# EAGLE board OSSIOBC (EAGLE 6.1)
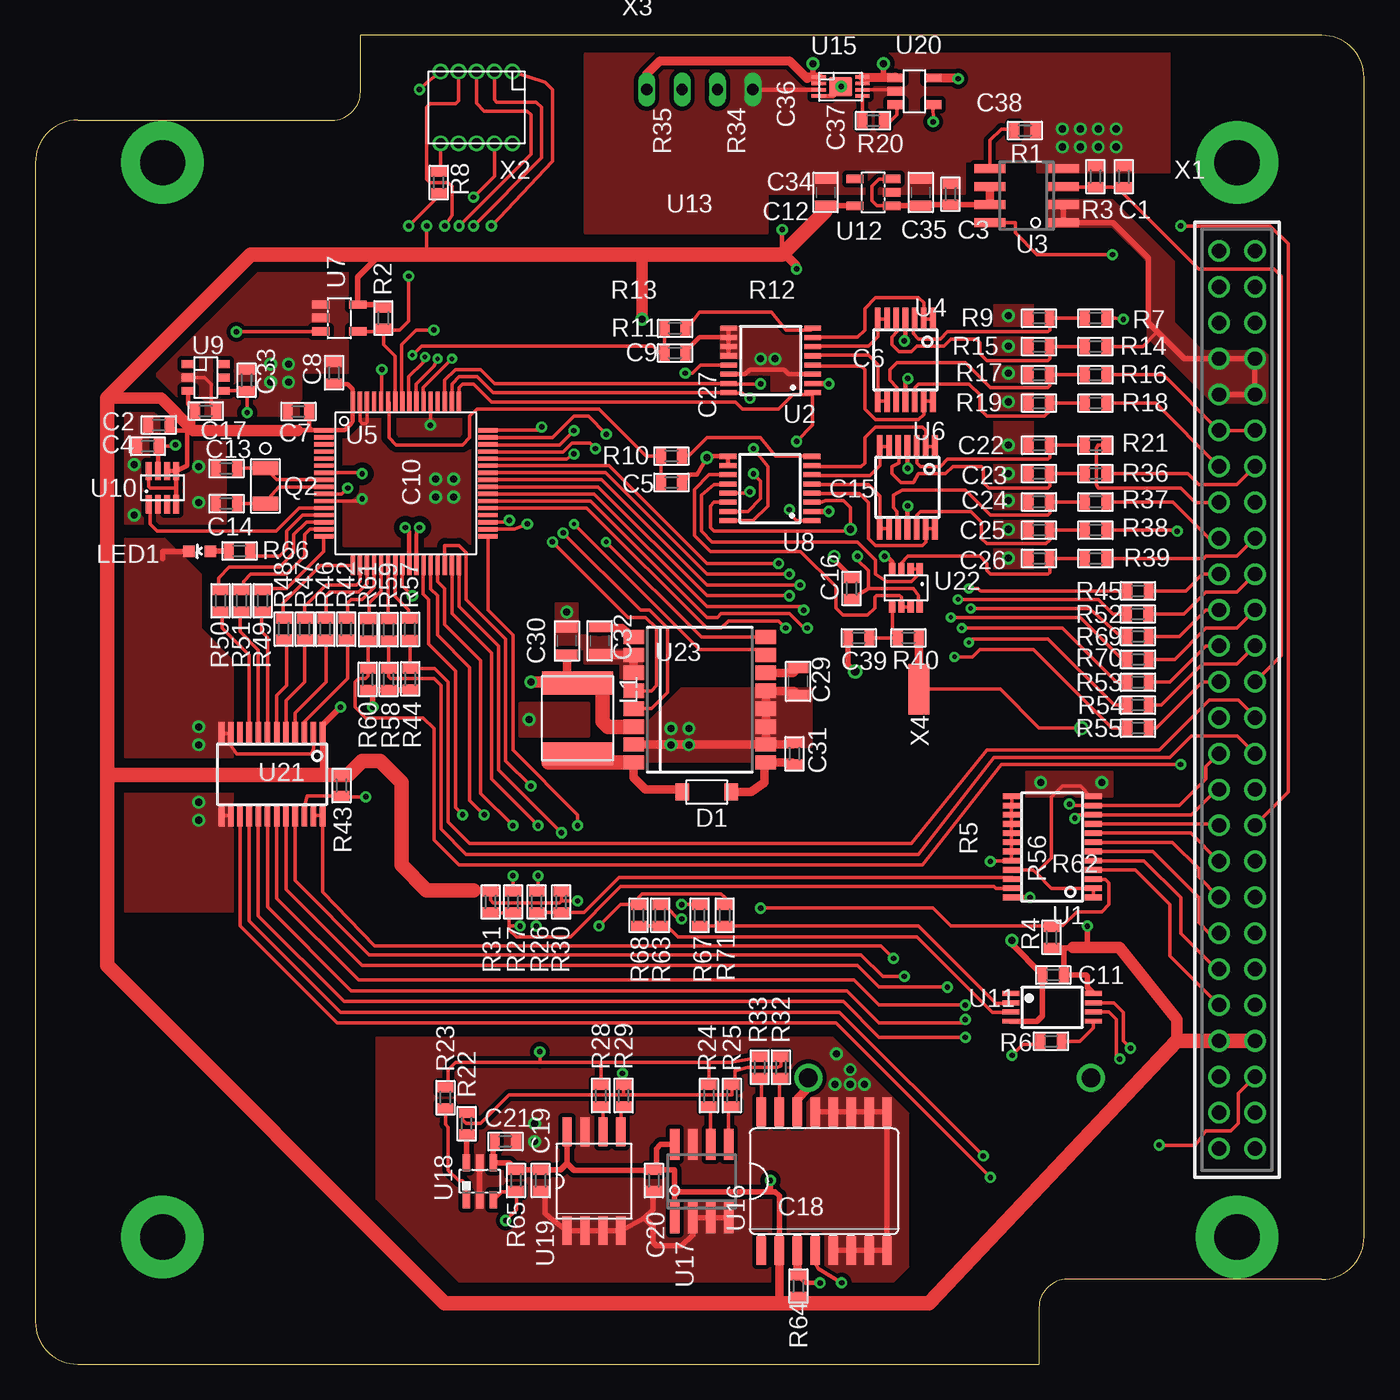
[diagram p4: board, top side]
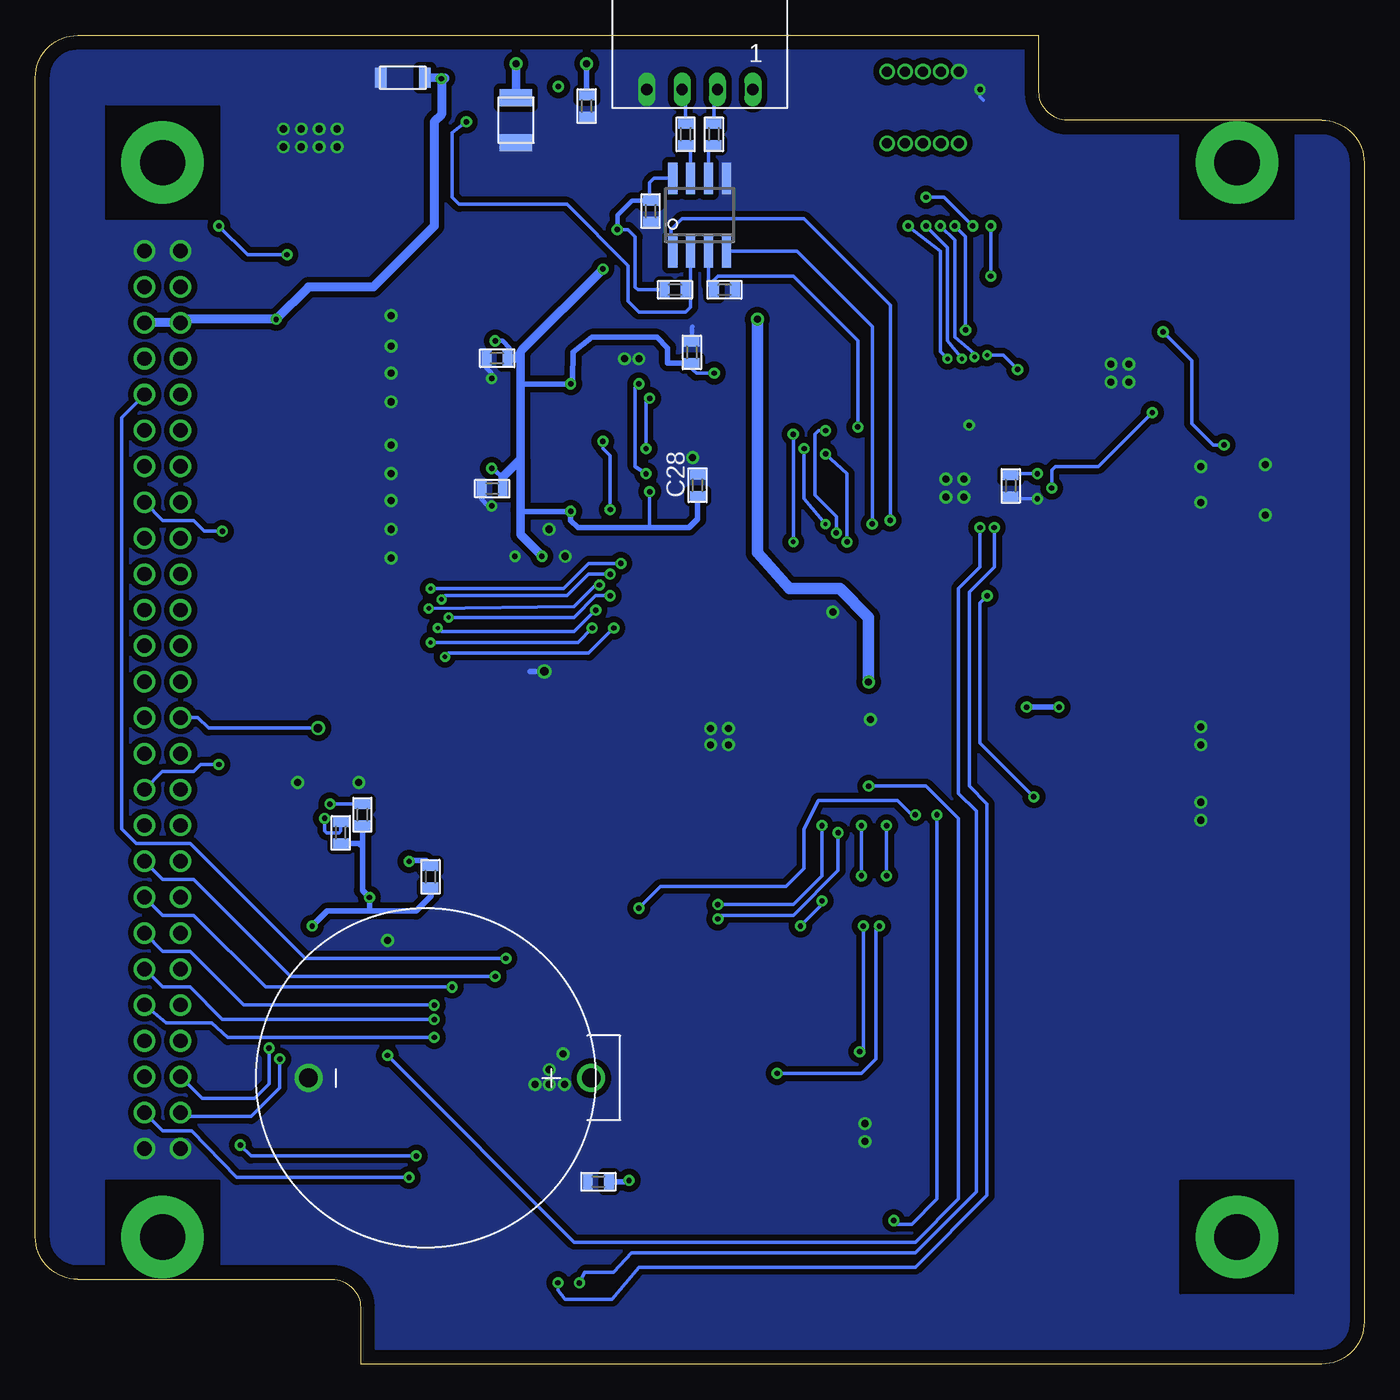
[diagram p5: board, bottom side, seen from below]

Size 94 x 94 mm. Coordinates in mm from the lower left corner, seen from the top.
Outline: 3,88 21,88 arc90 23,90 23,94 91,94 arc-90 94,91 94,9 arc-90 91,6 73,6 arc90 71,4 71,0 3,0 arc-90 0,3 0,85 arc-90 3,88
Copper layers (1*16): Top 0.035mm / dielectric 1.5mm / Bottom 0.035mm
Design rules: minimum track width 8mil, minimum drill 10mil, track to track 8mil, track to pad 8mil, pad to pad 4mil, via to via 8mil, smd to smd 2mil, copper to edge 40mil, drill to drill 8mil, minimum pad ring 8mil, minimum via ring 8mil, stop-mask expansion 4mil, vias tented up to drill 0mil, thermal gap 10mil

## Footprints (pad centres in the part's own frame; a part is rotated, then mirrored left to right if it is on the bottom)
BH32T-C-G = drill 1.32: N 0,8.3; P 0,-11.7
C0603(1608) = smd 0.7 x 1.1: 1 -0.75,0; 2 0.75,0
C0805(2012) = smd 0.7 x 1.5: 1 -0.95,0; 2 0.95,0
C1210-GCM32 = smd 1.2 x 2.3: P$1 -1.6,0; P$2 1.6,0
C1206-GCM31 = smd 0.8 x 1.4: P$1 -1.55,0; P$2 1.55,0
SOD-123 = smd 0.97 x 1.2: A -1.735,0; C 1.735,0
3.2-PAD-ROUND = drill 3.2 pad 5.842: B3,2 0,0
L(2220) = smd 1.6 x 5: P$1 -2.5,0; P$2 2.5,0
LED-0603 = smd 0.8 x 0.8: A 0,-0.75; C 0,0.75
NX-3215 = smd 1 x 1.8: 1 -1.25,0; 2 1.25,0
R0603(1608) = smd 0.7 x 1.1: 1 -0.75,0; 2 0.75,0
TSSOP-24-PW = smd 0.4 x 1.2: 1 -3.575,-2.9; 2 -2.925,-2.9; 3 -2.275,-2.9; 4 -1.625,-2.9; 5 -0.975,-2.9; 6 -0.325,-2.9; 7 0.325,-2.9; 8 0.975,-2.9; 9 1.625,-2.9; 10 2.275,-2.9; 11 2.925,-2.9; 12 3.575,-2.9; 13 3.575,2.9; 14 2.925,2.9; 15 2.275,2.9; 16 1.625,2.9; 17 0.975,2.9; 18 0.325,2.9; 19 -0.325,2.9; 20 -0.975,2.9; 21 -1.625,2.9; 22 -2.275,2.9; 23 -2.925,2.9; 24 -3.575,2.9
TSSOP16-RU = smd 1.19 x 0.36: 1 -2.97,2.275; 2 -2.97,1.625; 3 -2.97,0.975; 4 -2.97,0.325; 5 -2.97,-0.325; 6 -2.97,-0.975; 7 -2.97,-1.625; 8 -2.97,-2.275; 9 2.97,-2.275; 10 2.97,-1.625; 11 2.97,-0.975; 12 2.97,-0.325; 13 2.97,0.325; 14 2.97,0.975; 15 2.97,1.625; 16 2.97,2.275
SO8 = smd 0.65 x 2.2: 1 -1.905,-2.6; 2 -0.635,-2.6; 3 0.635,-2.6; 4 1.905,-2.6; 5 1.905,2.6; 6 0.635,2.6; 7 -0.635,2.6; 8 -1.905,2.6
TSSOP14-PW = smd 0.4 x 1.6: 1 -1.95,-2.9; 2 -1.3,-2.9; 3 -0.65,-2.9; 4 0,-2.9; 5 0.65,-2.9; 6 1.3,-2.9; 7 1.95,-2.9; 8 1.95,2.9; 9 1.3,2.9; 10 0.65,2.9; 11 0,2.9; 12 -0.65,2.9; 13 -1.3,2.9; 14 -1.95,2.9
PM/PAG64 = smd 1.4 x 0.3: 1 -5.8,3.75; 2 -5.8,3.25; 3 -5.8,2.75; 4 -5.8,2.25; 5 -5.8,1.75; 6 -5.8,1.25; 7 -5.8,0.75; 8 -5.8,0.25; 9 -5.8,-0.25; 10 -5.8,-0.75; 11 -5.8,-1.25; 12 -5.8,-1.75; 13 -5.8,-2.25; 14 -5.8,-2.75; 15 -5.8,-3.25; 16 -5.8,-3.75; 33 5.8,-3.75; 34 5.8,-3.25; 35 5.8,-2.75; 36 5.8,-2.25; 37 5.8,-1.75; 38 5.8,-1.25; 39 5.8,-0.75; 40 5.8,-0.25; 41 5.8,0.25; 42 5.8,0.75; 43 5.8,1.25; 44 5.8,1.75; 45 5.8,2.25; 46 5.8,2.75; 47 5.8,3.25; 48 5.8,3.75 | smd 0.3 x 1.4: 17 -3.75,-5.8; 18 -3.25,-5.8; 19 -2.75,-5.8; 20 -2.25,-5.8; 21 -1.75,-5.8; 22 -1.25,-5.8; 23 -0.75,-5.8; 24 -0.25,-5.8; 25 0.25,-5.8; 26 0.75,-5.8; 27 1.25,-5.8; 28 1.75,-5.8; 29 2.25,-5.8; 30 2.75,-5.8; 31 3.25,-5.8; 32 3.75,-5.8; 49 3.75,5.8; 50 3.25,5.8; 51 2.75,5.8; 52 2.25,5.8; 53 1.75,5.8; 54 1.25,5.8; 55 0.75,5.8; 56 0.25,5.8; 57 -0.25,5.8; 58 -0.75,5.8; 59 -1.25,5.8; 60 -1.75,5.8; 61 -2.25,5.8; 62 -2.75,5.8; 63 -3.25,5.8; 64 -3.75,5.8
SOT23-5DBV = smd 0.6 x 1.22: 1 -0.95,-1.3; 2 0,-1.3; 3 0.95,-1.3; 4 0.95,1.3; 5 -0.95,1.3
TSOT-6UJ-6 = smd 0.55 x 0.9: 1 -0.95,-1.25; 2 0,-1.25; 3 0.95,-1.25; 4 0.95,1.25; 5 0,1.25; 6 -0.95,1.25
SOT23-8 = smd 0.42 x 1.3: 1 -0.975,-1.175; 2 -0.325,-1.175; 3 0.325,-1.175; 4 0.975,-1.175; 5 0.975,1.175; 6 0.325,1.175; 7 -0.325,1.175; 8 -0.975,1.175
TSSOP-8 = smd 1.2 x 0.35: 1 -2.925,0.975; 2 -2.925,0.325; 3 -2.925,-0.325; 4 -2.925,-0.975; 5 2.925,-0.975; 6 2.925,-0.325; 7 2.925,0.325; 8 2.925,0.975
DFN8-2X3 = smd 0.25 x 1: 1 -0.675,-1.55; 2 -0.225,-1.55; 3 0.225,-1.55; 4 0.675,-1.55; 5 0.675,1.55; 6 0.225,1.55; 7 -0.225,1.55; 8 -0.675,1.55 | smd 1.35 x 1.65: 9 0,0
SO16L = smd 0.66 x 2.032: 1 -4.445,-4.902; 2 -3.175,-4.902; 3 -1.905,-4.902; 4 -0.635,-4.902; 5 0.635,-4.902; 6 1.905,-4.902; 7 3.175,-4.902; 8 4.445,-4.902; 9 4.445,4.902; 10 3.175,4.902; 11 1.905,4.902; 12 0.635,4.902; 13 -0.635,4.902; 14 -1.905,4.902; 15 -3.175,4.902; 16 -4.445,4.902
SOT23-6DBV = smd 0.55 x 1.2: 1 -0.95,-1.3; 2 0,-1.3; 3 0.95,-1.3; 4 0.95,1.3; 5 0,1.3; 6 -0.95,1.3
SO08-208 = smd 0.66 x 2.032: 1 -1.905,-3.498; 2 -0.635,-3.498; 3 0.635,-3.498; 4 1.905,-3.498; 5 1.905,3.498; 6 0.635,3.498; 7 -0.635,3.498; 8 -1.905,3.498
TSOT23-5 = smd 0.62 x 1.22: P$1 -0.95,-1.31; P$2 0,-1.31; P$3 0.95,-1.31; P$4 0.95,1.31; P$5 -0.95,1.31
PW_R-PDSO-G24 = smd 0.4 x 1.6: 1 -3.575,-2.9; 2 -2.925,-2.9; 3 -2.275,-2.9; 4 -1.625,-2.9; 5 -0.975,-2.9; 6 -0.325,-2.9; 7 0.325,-2.9; 8 0.975,-2.9; 9 1.625,-2.9; 10 2.275,-2.9; 11 2.925,-2.9; 12 3.575,-2.9; 13 3.575,2.9; 14 2.925,2.9; 15 2.275,2.9; 16 1.625,2.9; 17 0.975,2.9; 18 0.325,2.9; 19 -0.325,2.9; 20 -0.975,2.9; 21 -1.625,2.9; 22 -2.275,2.9; 23 -2.925,2.9; 24 -3.575,2.9
SOT23-8DCN = smd 0.45 x 0.8: 1 -0.975,-1.35; 2 -0.325,-1.35; 3 0.325,-1.35; 4 0.975,-1.35; 5 0.975,1.35; 6 0.325,1.35; 7 -0.325,1.35; 8 -0.975,1.35
SOIC-16CAV = smd 1 x 1.43: 1 -4.445,-4.67; 2 -3.175,-4.67; 3 -1.905,-4.67; 4 -0.635,-4.67; 5 0.635,-4.67; 6 1.905,-4.67; 7 3.175,-4.67; 8 4.445,-4.67; 9 4.445,4.67; 10 3.175,4.67; 11 1.905,4.67; 12 0.635,4.67; 13 -0.635,4.67; 14 -1.905,4.67; 15 -3.175,4.67; 16 -4.445,4.67
ESQ-126-XX-X-D = drill 1.016 pad 1.524: 1 -1.27,31.75; 2 1.27,31.75; 3 -1.27,29.21; 4 1.27,29.21; 5 -1.27,26.67; 6 1.27,26.67; 7 -1.27,24.13; 8 1.27,24.13; 9 -1.27,21.59; 10 1.27,21.59; 11 -1.27,19.05; 12 1.27,19.05; 13 -1.27,16.51; 14 1.27,16.51; 15 -1.27,13.97; 16 1.27,13.97; 17 -1.27,11.43; 18 1.27,11.43; 19 -1.27,8.89; 20 1.27,8.89; 21 -1.27,6.35; 22 1.27,6.35; 23 -1.27,3.81; 24 1.27,3.81; 25 -1.27,1.27; 26 1.27,1.27; 27 -1.27,-1.27; 28 1.27,-1.27; 29 -1.27,-3.81; 30 1.27,-3.81; 31 -1.27,-6.35; 32 1.27,-6.35; 33 -1.27,-8.89; 34 1.27,-8.89; 35 -1.27,-11.43; 36 1.27,-11.43; 37 -1.27,-13.97; 38 1.27,-13.97; 39 -1.27,-16.51; 40 1.27,-16.51; 41 -1.27,-19.05; 42 1.27,-19.05; 43 -1.27,-21.59; 44 1.27,-21.59; 45 -1.27,-24.13; 46 1.27,-24.13; 47 -1.27,-26.67; 48 1.27,-26.67; 49 -1.27,-29.21; 50 1.27,-29.21; 51 -1.27,-31.75; 52 1.27,-31.75
M50-3200545 = drill 0.7 pad 1: 1 -2.54,-2.54; 2 -2.54,2.54; 3 -1.27,-2.54; 4 -1.27,2.54; 5 0,-2.54; 6 0,2.54; 7 1.27,-2.54; 8 1.27,2.54; 9 2.54,-2.54; 10 2.54,2.54
22-05-7045 = drill 0.8 long: 1 -3.75,0; 2 -1.25,0; 3 1.25,0; 4 3.75,0
P-PAD-S = smd 3.556 x 1.5: 1 0,0

## Placement (x,y rotation side)
BAT1  BATTERY-BH32T  [BH32T-C-G]  66.38,20.25 90 bottom
C1  1uF  [C0603(1608)]  77,84 90 top
C2  100nF  [C0603(1608)]  8.73,66.43 180 top
C3  100nF  [C0603(1608)]  64.75,82.76 90 top
C4  100nF  [C0603(1608)]  7.96,64.94 180 top
C5  100nF  [C0603(1608)]  45,62.37 0 top
C6  100nF  [C0603(1608)]  61.33,71.16 180 bottom
C7  100nF  [C0603(1608)]  18.61,67.39 180 top
C8  100nF  [C0603(1608)]  21.13,70.13 90 top
C9  100nF  [C0603(1608)]  45.25,71.52 0 top
C10  100nF  [C0603(1608)]  25,62.13 270 bottom
C11  100nF  [C0603(1608)]  72,27.52 180 top
C12  100nF  [C0603(1608)]  50.48,81.57 270 bottom
C13  12.5pF  [C0603(1608)]  13.52,63.37 180 top
C14  12.5pF  [C0603(1608)]  13.52,60.87 180 top
C15  100nF  [C0603(1608)]  61.68,61.94 180 bottom
C16  100nF  [C0603(1608)]  57.75,54.87 90 top
C17  100nF  [C0603(1608)]  12.05,67.43 180 top
C18  100nF  [C0603(1608)]  54.17,12.9 180 bottom
C19  100nF  [C0603(1608)]  35.75,13 270 top
C20  100nF  [C0603(1608)]  43.75,13 270 top
C21  100nF  [C0603(1608)]  33.26,15.75 0 top
C22  100nF  [C0603(1608)]  71,65 180 top
C23  100nF  [C0603(1608)]  71,63 180 top
C24  100nF  [C0603(1608)]  71,61 180 top
C25  100nF  [C0603(1608)]  71,59 180 top
C26  100nF  [C0603(1608)]  71,57 180 top
C27  100nF  [C0603(1608)]  47.55,71.57 90 bottom
C28  100nF  [C0603(1608)]  47.16,62.18 90 bottom
C29  1uF 0805  [C0805(2012)]  53.95,48.3 270 top
C30  1uF 0805  [C0805(2012)]  37.6,51.15 90 top
C31  100nF  [C0603(1608)]  53.7,43.18 270 top
C32  1uF 0805  [C0805(2012)]  39.92,51.18 270 top
C33  100nF  [C0603(1608)]  14.95,69.6 270 top
C34  1uF 0805  [C0805(2012)]  55.91,82.89 90 top
C35  1uF 0805  [C0805(2012)]  62.63,82.89 90 top
C36  100nF  [C0603(1608)]  55,89 270 bottom
C37  10uF,3225  [C1210-GCM32]  60,88 270 bottom
C38  4.7uF, 1210  [C1206-GCM31]  68,91 180 bottom
C39  100nF  [C0603(1608)]  58.25,51.38 180 top
D1  MMSD4148T1G  [SOD-123]  47.5,40.46 0 top
H1  MOUNT-PAD-ROUND3.2  [3.2-PAD-ROUND]  9,85 0 top
H2  MOUNT-PAD-ROUND3.2  [3.2-PAD-ROUND]  9,9 0 top
H3  MOUNT-PAD-ROUND3.2  [3.2-PAD-ROUND]  85,9 0 top
H4  MOUNT-PAD-ROUND3.2  [3.2-PAD-ROUND]  85,85 0 top
L1  470uH, 240mA  [L(2220)]  38.35,45.69 270 top
LED1  [LED-0603]  11.62,57.5 90 top
Q2  NX-3215  [NX-3215]  16.27,62.13 270 top
R1  TBD  [R0603(1608)]  70,87.27 180 top
R2  100k  [R0603(1608)]  24.62,74 90 top
R3  100k  [R0603(1608)]  75,84 270 top
R4  100k  [R0603(1608)]  71.89,30.19 270 top
R5  10k  [R0603(1608)]  66.04,34.48 270 bottom
R6  1.5k  [R0603(1608)]  71.85,22.84 0 top
R7  100k  [R0603(1608)]  75,73.98 0 top
R8  4.7k  [R0603(1608)]  28.54,83.59 270 top
R9  100k  [R0603(1608)]  71,73.98 0 top
R10  10k  [R0603(1608)]  45,64.24 0 top
R11  10k  [R0603(1608)]  45.25,73.27 0 top
R12  470k  [R0603(1608)]  48.75,76 180 bottom
R13  470k  [R0603(1608)]  45.25,76 180 bottom
R14  100k  [R0603(1608)]  75,71.98 0 top
R15  100k  [R0603(1608)]  71,71.98 0 top
R16  100k  [R0603(1608)]  75,69.98 0 top
R17  100k  [R0603(1608)]  71,69.98 0 top
R18  100k  [R0603(1608)]  75,67.98 0 top
R19  100k  [R0603(1608)]  71,67.98 0 top
R20  0  [R0603(1608)]  59.27,87.97 180 top
R21  10k  [R0603(1608)]  75,65 0 top
R22  250  [R0603(1608)]  30.51,17.01 270 top
R23  250  [R0603(1608)]  29.01,18.84 270 top
R24  250  [R0603(1608)]  47.65,19 270 top
R25  250  [R0603(1608)]  49.27,19 270 top
R26  250  [R0603(1608)]  35.47,32.7 90 top
R27  250  [R0603(1608)]  33.8,32.7 90 top
R28  250  [R0603(1608)]  40,19 270 top
R29  250  [R0603(1608)]  41.62,19 270 top
R30  10k  [R0603(1608)]  37.2,32.7 90 top
R31  10k  [R0603(1608)]  32.2,32.7 90 top
R32  250  [R0603(1608)]  52.74,21 270 top
R33  250  [R0603(1608)]  51.24,21 270 top
R34  1k  [R0603(1608)]  48,87 270 bottom
R35  1k  [R0603(1608)]  46,87 270 bottom
R36  10k  [R0603(1608)]  75,63 0 top
R37  10k  [R0603(1608)]  75,61 0 top
R38  10k  [R0603(1608)]  75,59 0 top
R39  10k  [R0603(1608)]  75,57 0 top
R40  10k  [R0603(1608)]  61.76,51.38 0 top
R42  1.5k  [R0603(1608)]  22,52 90 top
R43  100k  [R0603(1608)]  21.66,40.93 90 top
R44  470k  [R0603(1608)]  26.53,48.47 270 top
R45  4.7k  [R0603(1608)]  78,54.7 180 top
R46  1.5k  [R0603(1608)]  20.51,52 90 top
R47  1.5k  [R0603(1608)]  19.06,52 90 top
R48  1.5k  [R0603(1608)]  17.57,52 90 top
R49  1.5k  [R0603(1608)]  16.08,54 90 top
R50  1.5k  [R0603(1608)]  14.59,54 90 top
R51  1.5k  [R0603(1608)]  13.1,54 90 top
R52  4.7k  [R0603(1608)]  77.98,53.06 180 top
R53  1.5k  [R0603(1608)]  78,48.24 180 top
R54  1.5k  [R0603(1608)]  78,46.62 180 top
R55  1.5k  [R0603(1608)]  78,45 180 top
R56  10k  [R0603(1608)]  70.87,38.86 270 bottom
R57  4.7k  [R0603(1608)]  26.49,51.98 90 top
R58  470k  [R0603(1608)]  25,48.45 270 top
R59  4.7k  [R0603(1608)]  25,51.96 90 top
R60  470k  [R0603(1608)]  23.51,48.45 270 top
R61  4.7k  [R0603(1608)]  23.54,51.96 90 top
R62  10k  [R0603(1608)]  72.39,37.59 270 bottom
R63  250  [R0603(1608)]  44.2,31.75 90 top
R64  470k  [R0603(1608)]  53.98,5.52 270 top
R65  470k  [R0603(1608)]  34,13 270 top
R66  4.7k  [R0603(1608)]  14.45,57.52 0 top
R67  250  [R0603(1608)]  46.99,31.75 90 top
R68  10k  [R0603(1608)]  42.67,31.75 90 top
R69  1.5k  [R0603(1608)]  78,51.48 180 top
R70  1.5k  [R0603(1608)]  78,49.86 180 top
R71  10k  [R0603(1608)]  48.77,31.75 90 top
U1  PCA9548APWR  [TSSOP-24-PW]  71.93,36.59 90 top
U2  ADG708  [TSSOP16-RU]  52.02,71 180 top
U3  MAX890L  [SO8]  70.12,82.66 90 top
U4  OPA4347  [TSSOP14-PW]  61.55,71.04 180 top
U5  MSP430F1611  [PM/PAG64]  26.21,62.31 0 top
U6  OPA4347  [TSSOP14-PW]  61.69,62.02 180 top
U7  TPS3838  [SOT23-5DBV]  21.51,74 270 top
U8  ADG708  [TSSOP16-RU]  51.96,61.95 180 top
U9  ADR127BUJZ-REEL7  [TSOT-6UJ-6]  12.06,69.8 270 top
U10  MAX6369  [SOT23-8]  9,62 0 top
U11  PCA9515APWR  [TSSOP-8]  71.93,25.24 0 top
U12  TPS73233  [SOT23-5DBV]  59.27,82.89 90 top
U13  SN65HVD11QD  [SO8]  47.01,81.28 0 bottom
U15  LTC4362-1  [DFN8-2X3]  56.97,90.37 270 top
U16  DS3231-L  [SO16L]  55.8,12.94 0 top
U17  FM24V02-G  [SO8]  47.14,12.94 0 top
U18  TMP101  [SOT23-6DBV]  31.44,12.94 0 top
U19  24LC256-8LEAD  [SO08-208]  39.52,12.94 0 top
U20  LTC4411  [TSOT23-5]  62.19,90.04 270 top
U21  SN74LVC8T245PWR  [PW_R-PDSO-G24]  16.75,41.72 180 top
U22  OPA2347  [SOT23-8DCN]  61.59,54.91 180 top
U23  ADXRS450SOIC  [SOIC-16CAV]  47,47 270 top
X1  ESQ-126-38-G-D  [ESQ-126-XX-X-D]  85,47 0 top
X2  JTAG10PINMINI-H  [M50-3200545]  31.21,88.9 180 top
X3  MOLEX-22-05-7045  [22-05-7045]  47,90.17 180 bottom
X4  P-PAD-S  [P-PAD-S]  62.5,47.75 90 top

## Tracks (layer width: path | path; a pad name or v marks a point on that pad's centre or on a via)
3.3VOBC  (via drill 0.38, 0.5)
  Top 0.254: C16.1 58.93,54.87 | 58.93,54.87 59.84,54.87 60.07,54.86 62.1,54.86 62.48,54.36 62.48,53.65 U22.8 | R31.2 32.2,32.82 32.38,32.64 37.08,32.64 37.21,32.77 | 37.21,32.77 37.21,33.44 R30.2 | U10.8 8.03,62.08 8.13,61.98 9.97,61.98 | 37.21,32.77 v38.35,32.77 | v39.88,30.99 41.4,32.51 42.67,32.51 R68.2 42.67,33.02 42.93,33.27 48.51,33.27 48.77,33.02 R71.2 | v58.17,57.15 58.17,56.9 58.93,56.13 58.93,54.88 58.93,54.87 | X2.4 32.48,84.04 v30.99,82.55 | v27.69,80.52 27.69,78.74 27.43,78.49 | 27.69,78.49 24.38,78.49 | U2.13 47.05,70.67 46.48,70.1 v45.97,70.1 | U8.13 50.19,61.62 v50.55,61.72
  Top 0.305: 19.56,66.06 U5.1 21.86,66.06 22.35,66.55 22.46,66.69 U5.64 22.46,68.98 22.1,69.34 21.16,69.34 C8.1 | 19.56,66.06 18.56,66.06 18.54,66.04 | C7.1 19.36,66.25 19.56,66.06 | 10.92,66.04 11.18,66.04 11.18,67.3 C17.2 10.81,67.92 U9.3 | 10.92,66.04 9.88,66.04 C2.1 | U10.5 10.74,63.57 10.74,65.86 10.92,66.04 | U10.5 U10.6 | U10.4 9.97,61.98 U10.5 | v52.83,80.26 52.83,78.74 52.83,78.49 | U4.4 61.55,72.72 v61.47,72.39 | U6.4 61.69,63.53 v61.72,63.37
  Top 0.406: U12.5 C34.1 55.91,81.56 | X1.45 | R31.2 31.07,33.45 30.99,33.53 | R64.2 54.86,4.58 55.12,4.32 | U16.2 52.62,11.9 52.33,12.19 52.06,12.19 | 52.06,12.19 45.47,12.19 45.21,11.94 | 45.21,11.94 45.21,10.36 U17.1 | U17.8 44.24,15.54 43.94,15.24 43.94,13.94 C20.1 | C20.1 45.18,13.75 45.21,13.72 45.21,11.94 | U19.8 37.62,14.2 | 37.62,14.2 38.1,13.72 43.72,13.72 C20.1 | 37.62,14.2 37.16,13.75 C19.1 R65.1 | R65.1 | C21.1 32.39,15.63 U18.4 33.51,14.24 R65.1 | R43.2 21.36,41.68 21.34,41.66 20.57,41.66 20.33,41.9 U21.1 20.33,45.22 v21.59,46.48 | v23.88,46.48 23.88,47.33 R60.2 R58.2 26.5,47.7 R44.2 | R4.2 72.9,29.44 | 72.9,29.44 73.38,29.44 73.41,29.46 | 72.9,29.44 72.75,29.3 C11.1 74.33,27.52 74.42,27.43 74.42,26.65 U11.8 | v74.42,30.99 74.42,29.46 | U1.24 v70.35,33.02 v70.36,33.02 | 24.38,78.49 22.81,76.91 U7.5 24.42,74.95 R2.2 | U2.2 56.1,69.38 v56.13,69.34 | U8.2 v56.13,60.32 v56.13,60.33 | v52,13 52,12.25 52.06,12.19
  Top 0.61: C30.1 37.6,48.25 37.08,48.26 38.28,48.26 L1.P$1 | 5.36,41.68 5.33,41.66 5.08,41.66 | v53.85,77.47 53.85,77.72 52.83,78.74 | R64.2 54.02,4.52 54,4.5 52.75,4.5 52.62,4.62 U16.2
  Top 0.813: U23.6 | 80.76,22.86 80.76,24.38 76.68,29.46 74.42,29.46 73.41,29.46 | 5.08,68.33 8.89,68.33 11.18,66.04 18.54,66.04 | 37.6,48.25 37.85,48.25 v35.05,48.26 | v42.93,73.91 42.93,78.49
  Top 1.016: 55.91,81.56 52.83,78.49 42.93,78.49 27.69,78.49 27.43,78.49 24.38,78.49 15.24,78.49 5.08,68.33 5.08,41.66 5.08,28.19 28.96,4.32 55.12,4.32 63.21,4.32 80.76,22.86 X1.45 | X1.45 X1.46 | L1.P$1 39.95,48.19 40.13,48.01 40.13,45.47 40.51,45.09 U23.6 | 5.36,41.68 R43.2 22.12,41.68 23.11,42.67 24.38,42.67 25.91,41.15 25.91,35.31 27.69,33.53 30.99,33.53
  Bottom 0.254: U13.8 50.23,83.88 50.55,83.57 50.55,82.39 C12.1 | R12.2 51.36,76 51.56,76.2 51.56,79.76 52.07,80.26 v52.83,80.26 | v38.35,32.77 38.35,32.51 v39.88,30.99 | v30.99,82.55 29.72,82.55 v27.69,80.52 | v45.97,70.1 47.24,70.1 47.5,70.36 47.5,70.87 C27.1 | v50.55,61.72 50.55,59.18
  Bottom 0.305: C12.1 51.79,82.32 52.83,81.28 v52.83,80.26 | v61.47,72.39 60.96,72.39 60.45,71.88 60.45,71.12 60.49,71.16 C6.1 | v61.72,63.37 60.96,62.74 59.69,64.01
  Bottom 0.406: v21.59,46.48 v23.88,46.48 | 70.36,32.04 67.08,32.04 66,33.12 66.04,33.17 R5.2 | 70.36,32.04 73.37,32.04 v74.42,30.99 | 70.36,32.04 70.36,32.3 v70.36,33.02 70.87,33.53 70.87,36.58 | R56.2 70.87,36.58 | R62.2 71.13,36.84 70.87,36.58 | 59.69,69.34 v56.13,69.34 56.1,69.38 56.01,69.63 55.95,71.59 54.61,72.64 50.04,72.64 49.28,71.88 49.28,70.82 C27.1 | 59.69,60.45 59.56,60.33 v56.13,60.33 56.13,59.69 55.63,59.18 50.55,59.18 47.75,59.18 47.16,59.78 C28.1 | C18.1 52.1,12.9 v52,13
  Bottom 0.61: C6.1 59.94,71.11 | 59.94,71.11 59.57,71.75 v53.85,77.47 | C15.1 60.93,62.77 59.69,64.01 | 59.69,64.01 59.69,69.34 59.69,71.5 59.94,71.11 | 59.69,64.01 59.69,60.45 59.69,58.67 v58.17,57.15
  Bottom 0.813: v35.05,48.26 35.05,52.83 37.08,54.86 40.64,54.86 42.93,57.4 v42.93,73.91
/RE  (via drill 0.38)
  Top 0.254: v63.52,87.88 U20.P$4
  Bottom 0.254: R12.1 47.65,76.36 U13.2 47.65,74.78 48.01,74.42 51.31,74.42 52.07,75.18 52.07,77.72 56.39,82.04 64.01,82.04 64.52,82.55 64.52,87.12 v63.52,87.88
A
  Bottom 0.254: R35.1 46,89.92 X3.2
ADC0
  Top 0.254: U5.59 25.02,68.05 25.02,65.53 25.53,65.02 30.23,65.02 30.73,65.53 30.73,67.06 31.24,67.56 39.88,67.56 43.2,64.24 R10.1 C5.1
ADC1  (via drill 0.3, 0.38)
  Top 0.254: v26.67,71.37 27.33,72.03 43.69,72.01 44.2,71.52 C9.1 R11.1 | v24.51,70.36 24.51,68.16 U5.60
  Bottom 0.254: v26.67,71.37 25.53,71.37 v24.51,70.36
ANT_-CHECK
  Top 0.406: R66.1 12.38,57.52 LED1.A
ANT_DEPLOY1
  Top 0.254: R45.1 81.37,54.7 82.55,55.88 83.82,55.88 83.81,55.89 X1.19
ANT_DEPLOY2
  Top 0.254: R52.1 81.26,53.06 82.8,54.61 84.99,54.61 X1.20
B
  Bottom 0.254: R34.1 48,89.92 X3.3
BAT_-CHRG  (via drill 0.38)
  Top 0.254: U21.18 16.43,32.34 22.35,26.42 57.4,26.42 59.69,24.13 65.53,24.13 v65.79,24.38
  Bottom 0.254: v65.79,24.38 80.77,24.38 83.06,26.67 84.99,26.67 X1.42
BAT_-CHRG_IN
  Top 0.254: U5.17 20.19,56.51 17.53,53.85 17.53,52.8 R48.2
BAT_-FAULT  (via drill 0.38)
  Top 0.254: U21.17 15.78,31.72 21.84,25.65 57.15,25.65 59.69,23.11 v65.79,23.11
  Bottom 0.254: v65.79,23.11 80.39,23.11 81.53,24.13 84.74,24.13 X1.44
BAT_-FAULT_IN
  Top 0.254: U5.16 20.41,57.49 17.78,54.86 16.19,54.86 R49.2
BAT_-ON  (via drill 0.38)
  Top 0.254: U21.20 17.73,33.58 23.11,28.19 58.17,28.19 59.69,26.67 v64.52,26.67
  Bottom 0.254: v64.52,26.67 77.72,26.67 82.8,31.75 84.99,31.75 X1.38
BAT_-ON_IN
  Top 0.254: U5.19 23.46,55.21 22.86,54.61 20.83,54.61 20.57,54.36 20.57,52.82 R46.2
BEACON_-FAULT
  Top 0.254: R59.1 R58.1 25,48.66 25.15,48.51 28.19,48.51 28.7,48.01 28.7,37.85 30.48,36.07 62.48,36.07 67.82,42.93 80.26,42.93 81.79,44.45 85.01,44.45 X1.30
BEACON_-FAULT_IN
  Top 0.254: U5.22 24.96,52.74 R59.2
BEACON_OFF
  Top 0.254: R54.1 79.64,46.62 82.55,49.53 84.99,49.53 X1.24
BEACON_OFF_OUT  (via drill 0.3, 0.38)
  Top 0.254: R54.2 76.32,46.62 71.63,51.31 66.29,51.31 v66.04,51.05 | U5.38 39.27,61.06 47.5,52.83 48.26,52.83 48.51,53.09 53.34,53.09 54.36,52.07 v54.61,52.07
  Bottom 0.254: v66.04,51.05 55.63,51.05 v54.61,52.07
BEACON_SCL
  Top 0.254: U1.7 80.43,36.91 82.3,35.05 82.3,34.46 X1.37
BEACON_SDA
  Top 0.254: U1.6 79.05,36.27 82.3,33.02 82.3,31.24 83.06,30.48 X1.39
COMMS_-FAULT  (via drill 0.38)
  Top 0.254: R61.1 23.54,49.23 | 23.54,49.23 R60.1 | 23.54,49.23 23.54,48.69 23.37,48.51 22.86,48.51 22.61,48.26 22.61,46.48 23.37,45.72 27.43,45.72 28.19,44.96 28.19,37.08 29.97,35.31 62.74,35.31 68.33,42.42 v81.03,42.42
  Bottom 0.254: v81.03,42.42 82.3,42.42 82.8,41.91 85.01,41.91 X1.32
COMMS_-FAULT_IN
  Top 0.254: U5.21 24.46,54.69 23.62,53.85 23.62,52.79 R61.2
COMMS_OFF
  Top 0.254: R55.1 79.29,45 82.55,48.26 X1.25
COMMS_OFF_OUT  (via drill 0.3, 0.38)
  Top 0.254: R55.2 76.16,45 70.61,50.55 66.8,50.55 66.29,50.04 v65.02,50.04 | U5.37 39.01,60.56 47.5,52.07 48.51,52.07 49.02,52.58 52.58,52.58 v53.09,52.07
  Bottom 0.254: v53.09,52.07 54.86,50.29 64.77,50.29 v65.02,50.04
COMMS_SCL
  Top 0.254: U1.5 78.43,35.62 81.03,33.02 81.03,30.48 83.57,27.94 83.82,27.94 83.81,27.95 X1.41
COMMS_SDA
  Top 0.254: U1.4 77.81,34.97 80.26,32.51 80.26,28.88 X1.43
DE  (via drill 0.38)
  Top 0.254: U5.48 35.58,66.06 v35.81,66.29
  Bottom 0.254: U13.3 46.38,76.38 R13.2 46,75.92 46.23,75.69 46.23,76.45 45.72,76.96 40.39,76.96 35.81,72.39 v35.81,66.29
GND  (via drill 0.38, 0.5, 0.6)
  Top 0.254: U5.11 22.96,61.06 v23.11,61.21 | U21.14 U21.13 | U21.12 U21.11 13.72,44.51 13.72,43.94 14.22,43.18 19.56,43.18 19.68,43.55 U21.2 | U1.21 70.57,34.97 70.8,34.73 | 70.8,34.73 71.88,33.66 74.82,33.66 U1.2 U1.1 | U1.12 74.64,40.16 73.91,40.89 72.64,40.89 71.88,40.13 71.88,35.81 70.8,34.73 | U5.63 22.96,66.7 23.11,66.55 23.37,66.55 23.46,66.64 U5.62 | U5.53 27.96,66.57 27.94,66.55 | U9.2 11.99,69.8 12.45,69.34 12.45,67.78 C17.1 | U8.3 55.64,60.97 55.88,61.09 57.15,61.09 57.66,60.58 v57.66,59.05 | X2.9 27.71,90.7 v27.18,90.17 | 57.66,58.93 v57.66,59.05 | U8.14 48.02,60.97 47.75,60.71 47.75,59.18 48.01,58.93 57.53,58.93 v57.66,59.05 | U15.6 60.77,90.15 U20.P$2 | v47.5,64.14 47.5,64.13 47.5,64.12
  Top 0.305: U4.11 61.55,69.42 v61.72,69.72 | U6.11 61.69,60.67 v61.72,60.71 | C5.2 46.3,62.92 46.81,62.94 v47.5,64.14 | U8.10 U8.9 47.59,64.22 47.5,64.12 | U2.9 U2.10 | U2.10 U2.11 49.05,71.4 49.02,71.37 49.05,71.35 U2.12 | C9.2 46,71.66 46.99,72.64 49.03,72.64 U2.10 | U2.14 50.21,70.03 50.55,70.36 52.96,70.36 53.29,70.03 U2.3 | U22.4 60.62,56.73 60.2,57.15 v60.07,57.15 | C16.2 57.75,55.66 56.52,56.9 v56.52,57.15 | U15.3 50.82,90.15 50.8,90.17 X3.4
  Top 0.406: U18.2 U18.5 | U17.4 U17.3 U17.2 46.51,9.17 45.72,8.38 43.94,8.38 43.69,8.64 43.69,9.76 43.11,10.34 | U11.4 70.87,24.26 71.25,24.64 C11.2 71.25,27.55 69.09,29.72 v69.09,29.97 | U16.13 U16.12 U16.11 U16.10 U16.9 U16.8 U16.7 U16.6 U16.5 | 43.11,10.34 U19.4 U19.3 U19.2 U19.1 36.4,10.34 36.07,10.67 36.07,12.19 C19.2 | 43.11,10.34 43.69,10.92 43.69,12.19 C20.2 | LED1.C 9,57.5 9,57 | C39.2 57.5,49.5 v58,49
  Top 0.61: U23.10 53.6,43.83 C31.1 | C32.2 40.13,50.17 U23.2 U23.3 | U23.10 U23.11 U23.12 U23.13 53.67,47.63 C29.2 | U23.10 U23.7
  Bottom 0.254: v23.11,61.21 24.84,61.21 C10.2 | v27.18,90.17 27.18,89.66 26.92,89.41
  Bottom 0.305: v61.72,69.72 61.72,70.1 62.1,70.48 62.1,71.14 C6.2 | v61.72,60.71 61.98,60.71 62.48,61.21 62.48,61.98 62.47,61.98 C15.2 | C27.2 47.55,73.35 47.5,73.41 | C28.2 47.18,62.93 47.5,63.25
  Bottom 0.406: v58,49 59,49
  other vias: 44.96,44.96 37.59,53.21 46.23,44.96 44.96,43.81 46.23,43.81 68.83,68.07 68.83,65.02 68.83,70.1 68.83,72.01 68.83,74.17 68.83,62.99 68.83,61.09 68.83,59.05 68.83,57.02 51.31,71.12 52.32,71.12 71.12,41.15 75.44,41.15 57.64,20.84 58.66,19.79 56.67,21.95 56.56,19.79 35.31,15.75 35.31,17.02 34.92,45.59 11.56,63.5 11.56,60.96 6.99,60.07 6.99,63.63 16.64,70.74 17.91,70.74 16.64,69.47 17.91,69.47 27.94,66.42 28.32,61.34 29.59,62.61 29.59,61.34 28.32,62.61 11.56,45.09 11.56,43.81 11.56,39.75 11.56,38.48 72.64,87.38 73.91,87.38 75.18,87.38 72.64,86.11 73.91,86.11 75.18,86.11 76.45,87.38 76.45,86.11 57.64,19.79
  pour Bottom (isolate 0.406, no thermals): 23,94 23,88 0,88 0,87 0,0 71,0 71,6 94,6 94,94
  pour Top (isolate 0.254, no thermals): 54.86,47.75 45.72,47.75 43.43,45.47 43.43,42.67 50.55,42.67 50.55,43.69 54.86,43.69
  pour Top (isolate 0.254, no thermals): 36.83,53.85 38.35,53.85 38.35,51.56 40.64,51.56 40.64,50.55 42.93,50.55 42.93,48.51 41.4,48.51 41.4,49.53 38.86,49.53 38.86,50.55 36.83,50.55
  pour Top (no thermals): 70.61,56.13 70.61,74.93 67.82,74.93 67.82,56.13
  pour Top (no thermals): 48.51,73.41 52.32,73.41 52.83,72.9 54.1,72.9 54.1,70.1 55.5,70.1 55.5,69.98 54.1,69.98 54.1,68.83 52.07,68.83 52.07,69.98 48.51,69.98 48.51,70.1 50.04,70.1 50.04,71.12 48.51,71.12
  pour Top (no thermals): 75.44,40.13 70.1,40.13 70.1,41.91 76.2,41.91 76.2,40.13
  pour Top (isolate 0.305, no thermals): 24.13,23.11 56.39,23.11 61.72,17.78 61.72,6.86 60.71,5.84 29.97,5.84 24.13,11.68
  pour Top (no thermals): 34.29,46.74 34.29,44.45 39.12,44.45 39.12,46.74
  pour Top (isolate 0.305, no thermals): 6.35,59.44 6.35,67.31 8.38,67.31 10.67,65.28 13.46,65.28 13.46,59.44
  pour Top (isolate 0.305, no thermals): 8.64,70.1 15.75,77.22 22.1,77.22 22.1,70.1 18.8,70.1 18.8,67.06 11.43,67.06 8.64,69.85
  pour Top (isolate 0.406, no thermals): 21.84,66.8 30.73,66.8 30.73,57.91 21.84,57.91
  pour Top (isolate 0.305, no thermals): 13.97,42.93 6.35,42.93 6.35,58.42 9.14,58.42 11.68,55.88 11.68,52.07 13.97,49.78
  pour Top (isolate 0.305, no thermals): 6.35,40.39 13.97,40.39 13.97,32 6.35,32
  pour Top (isolate 0.305, no thermals): 54.61,82.8 65.79,82.8 65.79,85.09 70.87,85.09 70.87,84.33 80.26,84.33 80.26,92.71 38.86,92.71 38.86,80.01 51.82,80.01 51.82,82.8
GYRO_-CS  (via drill 0.38)
  Top 0.254: U5.44 32.06,64.01 37.59,64.01 v38.1,64.39 | v36.58,58.17 41.91,52.83 43.18,52.83 43.94,52.07 43.94,48.01 43.57,47.63 U23.4
  Bottom 0.254: v38.1,64.39 36.58,62.99 v36.58,58.17
GYRO_SCLK  (via drill 0.3, 0.38)
  Top 0.254: U5.47 32.04,65.53 36.58,65.53 38.1,67.06 39.12,67.06 v40.39,65.79 | v40.39,58.17 47.11,51.45 U23.16
  Bottom 0.254: v40.39,65.79 v40.39,58.17
GYRO_SI  (via drill 0.3, 0.38)
  Top 0.254: U5.45 32.05,64.52 37.34,64.52 37.97,65.15 39.24,65.15 v39.62,64.77 | U23.15 51.3,50.55 46.99,50.55 v38.1,59.44
  Bottom 0.254: v38.1,59.44 39.62,61.21 v39.62,64.77
GYRO_SO  (via drill 0.38)
  Top 0.254: U5.46 32.05,65.02 37.08,65.02 v38.1,66.04 | v37.34,58.8 42.8,53.34 43.43,53.34 44.7,52.07 44.7,47.5 43.57,46.37 U23.5
  Bottom 0.254: v38.1,66.04 38.61,66.04 38.86,65.79 38.86,61.47 37.34,59.94 v37.34,58.8
I2C_-RST  (via drill 0.38)
  Top 0.254: U5.28 27.96,54.84 28.45,54.36 28.45,51.56 30.73,49.28 30.73,39.88 v31.75,38.86 | 71.63,30.99 71.88,31.03 | 71.88,31.03 R4.1 71.84,30.99 64.77,30.99 63.5,32.26 v51.31,32.26 | 71.88,31.03 72.69,31.03 73.66,32 75.44,32 75.95,32.51 75.95,34.04 75.69,34.29 74.93,34.29 74.91,34.31 U1.3
  Bottom 0.254: v31.75,38.86 32,38.86 33.02,39.88 38.61,39.88 39.62,37.85 39.62,35.05 40.89,33.78 49.78,33.78 v51.31,32.26
I2C_SCL  (via drill 0.38)
  Top 0.254: R33.1 51.62,21.77 49.18,21.34 47.5,21.34 | 47.5,21.34 39.88,21.34 | 39.88,21.34 35.69,21.34 | 35.69,21.34 29.72,21.34 29.21,20.83 29.21,19.81 28.99,19.59 | R23.1 28.99,19.59 | 28.99,19.59 28.96,19.56 | U1.22 69.13,34.42 41.27,34.42 38.81,31.95 R30.1 R26.1 35.47,30.95 v35.43,30.99 | v35.69,22.1 35.69,21.34 | R28.1 40,21.21 39.88,21.34 | R24.1 47.65,21.18 47.5,21.34
  Bottom 0.254: v35.43,30.99 35.43,22.35 v35.69,22.1
I2C_SDA  (via drill 0.38)
  Top 0.254: 41.62,19.05 49.28,19.05 49.27,19.06 R25.1 49.15,19.81 49.15,19.75 | R22.1 30.23,17.48 30.23,17.27 30.48,17.02 31.5,17.02 33.53,19.05 41.62,19.05 | 33.53,30.99 33.53,30.73 34.04,30.23 37.85,30.23 41.41,33.79 67.82,33.78 67.94,33.66 U1.23 | 33.53,30.99 33.53,31.93 | 33.53,31.93 R27.1 | 33.53,31.93 32.47,31.93 R31.1 | v41.53,20.57 41.62,20.48 R29.1 41.62,19.05 | v34.29,30.99 33.53,30.99 | R32.1 52.74,21.11 52.5,21 50.38,21 49.5,20.75 49.5,20.25 49,19.75 49.15,19.75 | 49.15,19.75 49.25,19.75
  Bottom 0.254: v41.53,20.57 35.56,20.57 34.54,21.59 34.54,30.73 v34.29,30.99
I2CSEC_EN  (via drill 0.38)
  Top 0.254: 28.96,56.64 28.96,57.91 29.97,57.91 30.48,57.4 30.48,54.1 33.27,51.31 33.27,42.67 v35.05,40.89 | v69.09,21.84 69.85,22.61 70.87,22.61 R6.1 | R6.1 | R6.1 71.12,22.86 | U5.30 28.96,56.64 | U5.30 28.96,56.64
  Bottom 0.254: v35.05,40.89 30.99,40.89 28.7,38.61 28.7,11.68 31.75,8.64 55.88,8.64 v69.09,21.84
I2CSEC_SCL
  Top 0.254: R71.1 R67.1 62.47,31 67.94,25.53 68.97,25.53 U11.2
I2CSEC_SDA
  Top 0.254: R68.1 R63.1 44.69,31 45.47,30.23 62.36,30.23 67.69,24.89 68.98,24.89 U11.3
IO_-OE  (via drill 0.38)
  Top 0.254: U5.24 25.96,55.07 v26.67,54.36 | v23.37,40.13 21.59,40.13 21.41,40.33 R43.1 19.23,40.18 19.05,39.5 19.05,38.84 U21.22
  Bottom 0.254: v26.67,54.36 27.18,53.85 27.18,43.94 v23.37,40.13
LED_-FAULT
  Top 0.254: R57.1 26.5,49.25 R44.1 28.25,49.22 29.21,48.26 29.21,38.35 30.73,36.83 61.98,36.83 67.31,43.43 79.5,43.43 83.06,46.99 85.09,46.99 86.36,45.72 X1.28
LED_-FAULT_IN
  Top 0.254: U5.23 25.46,54.3 26.42,53.34 26.42,52.81 R57.2
LED_OFF
  Top 0.254: R53.1 80.24,48.24 82.8,50.8 X1.23
LED_OFF_OUT  (via drill 0.3, 0.38)
  Top 0.254: R53.2 76.48,48.24 72.64,52.07 v65.53,52.07 | U5.39 39.53,61.56 47.5,53.59 54.1,53.59 v54.36,53.34
  Bottom 0.254: v54.36,53.34 55.88,51.82 65.28,51.82 v65.53,52.07
LED_SCL
  Top 0.254: U1.9 83.62,38.22 X1.33
LED_SDA
  Top 0.254: U1.8 81.73,37.56 X1.35
MUX_A0  (via drill 0.38)
  Top 0.254: v53.85,65.28 54.99,66.42 U2.1 54.84,68.58 53.59,68.58 52.58,67.56 50.04,67.56 49.53,68.07 32.26,68.07 30.99,69.34 30.23,69.34 29.96,69.08 U5.49 | v53.34,60.45 53.34,60.2 53.85,59.69 54.91,59.69 U8.1
  Bottom 0.254: v53.85,65.28 53.85,64.77 53.34,64.26 v53.34,60.45
MUX_A1  (via drill 0.38)
  Top 0.254: U8.16 50.78,59.67 51.82,60.71 51.82,63.5 v50.8,64.77 | v50.55,68.33 50.42,68.33 50.04,68.71 49.06,68.71 U2.16 32.37,68.72 31.24,69.85 29.97,69.85 29.46,69.34 U5.50
  Bottom 0.254: v50.8,64.77 50.8,68.07 v50.55,68.33
MUX_A2  (via drill 0.38)
  Top 0.254: U8.15 50.41,60.32 51.31,61.21 51.31,62.48 v50.8,62.99 | v51.31,69.34 49.08,69.34 U2.15 32.48,69.38 31.5,70.36 29.72,70.36 28.96,69.6 U5.51
  Bottom 0.254: v50.8,62.99 51.56,63.5 51.56,69.09 v51.31,69.34
N$1
  Top 0.254: U5.12 18.65,60.56 17.02,58.93 8.64,58.93 8.13,59.44 8.13,60.71 8.03,60.81 U10.1
N$2
  Top 0.254: R7.1 R9.2 71.75,73.15 71.63,73.03 64.52,73.03 64.01,72.52 62.48,72.52 62.1,72.9 62.1,73.84 U4.3
N$3
  Top 0.254: U2.7 55.01,72.64 58.17,72.64 58.67,73.15 58.67,74.68 59.44,75.44 62.48,75.44 62.85,75.07 U4.2 U4.1
N$4  (via drill 0.5)
  Top 0.254: U15.2 U15.1
  Top 0.406: v55,92 55,91 55.42,91 U15.1
  Top 0.635: X3.1 43.25,91.26 44.2,92.2 53.34,92.2 54.61,90.93 54.72,91.05 U15.1
  Bottom 0.406: C36.1 v55,92
N$5
  Top 0.254: C13.1 14.79,63.38 Q2.1 17.09,62.56 U5.8
N$6
  Top 0.254: C14.1 14.79,60.88 Q2.2 16.27,60.95 16.26,60.96 17.23,62.06 U5.9
N$7
  Top 0.254: U16.15 52.62,20.26 R32.2
N$8
  Top 0.254: U2.6 55.02,72.01 58.93,72.01 59.6,72.68 U4.7 U4.6
N$9
  Top 0.254: U2.5 55.03,71.37 58.93,71.37 59.6,70.7 U4.8 U4.9
N$10
  Top 0.254: U3.5 67.52,86.57 68.33,87.38 69.34,87.38 69.25,87.28 R1.2
N$11
  Top 0.254: U2.4 55.05,70.61 58.42,70.61 58.67,70.36 58.67,67.56 59.44,66.8 62.48,66.8 62.85,67.17 U4.13 U4.14
N$12
  Top 0.254: U8.7 55,63.5 58.42,63.5 58.67,63.75 58.67,65.53 59.44,66.29 62.74,66.29 62.99,66.04 U6.2 U6.1
N$13  (via drill 0.38)
  Top 0.254: U5.7 23.05,63.06 v23.11,62.99
  Bottom 0.254: v23.11,62.99 25.15,62.99 25.03,62.88 C10.1
N$14
  Bottom 0.254: U13.7 47.65,85.89 R34.2
N$15
  Top 0.254: U16.16 51.35,20.14 R33.2
N$16  (via drill 0.38)
  Top 0.254: U1.13 69.09,40.16 69.09,39.62 69.03,39.62 U1.14 U1.15 U1.16 U1.17 U1.18 U1.19 U1.20 67.56,35.62 v67.56,35.56
  Bottom 0.406: R5.1 66.04,35.29 66.38,35.62 67.5,35.62 v67.56,35.56 | v67.56,35.56 | v67.56,35.56 67.62,35.5
N$17  (via drill 0.38)
  Top 0.254: X2.7 29.94,89.38 29.72,89.15 27.94,89.15 27.69,88.9 27.69,83.82 27.94,83.57 29.21,83.57 29.46,83.31 29.46,81.28 v28.96,80.52 | U5.57 25.91,68.16 25.91,72.14 26.92,73.15 v28.19,73.15
  Bottom 0.254: v28.96,80.52 28.19,79.76 v28.19,73.15
N$18  (via drill 0.3, 0.38)
  Top 0.254: X2.5 31.21,89.19 31.75,88.65 34.8,88.65 35.05,88.39 35.05,85.6 v29.97,80.52 | U5.56 26.42,68.15 26.42,69.85 27.43,70.87 27.43,71.12 v27.56,71.25
  Bottom 0.254: v29.97,80.52 28.96,79.5 28.96,72.64 27.56,71.5 v27.56,71.25
N$19  (via drill 0.3, 0.38)
  Top 0.254: X2.3 32.48,89.44 32.64,89.28 35.43,89.28 35.81,88.9 35.81,85.34 v30.99,80.52 | v28.45,71.12 28.19,70.61 26.92,69.34 26.92,68.15 U5.55
  Bottom 0.254: v30.99,80.52 29.46,78.99 29.46,72.39 v28.45,71.12
N$20  (via drill 0.3, 0.38)
  Top 0.254: X2.1 36.05,90.7 36.58,90.17 36.58,85.09 v32.26,80.52 | U5.54 27.43,68.14 27.43,69.09 v29.46,71.12
  Bottom 0.254: v32.26,80.52 29.97,78.74 29.97,71.63 v29.46,71.12
N$21
  Top 0.254: U6.6 U6.7 59.74,63.55 59.05,62.87 54.99,62.87 U8.6
N$22
  Bottom 0.254: U13.6 46.38,85.88 R35.2
N$23
  Top 0.254: X2.10 28.67,84.61 28.7,84.58 28.46,84.34 | R8.1 28.46,84.34 | 28.46,84.34 28.45,84.33
N$24
  Top 0.254: R14.1 R15.2 71.75,71.11 71.63,70.99 67.31,70.99 66.8,71.5 66.8,72.26 66.55,72.52 64.77,72.52 64.26,72.01 62.36,72.01 61.98,71.63 61.09,71.63 60.58,72.14 60.58,72.64 60.96,73.03 60.96,73.88 U4.5
N$25
  Top 0.254: R16.1 R17.2 71.75,69.21 71.63,69.09 67.56,69.09 65.79,70.87 60.96,70.87 60.45,70.36 60.45,69.6 60.96,69.09 60.96,68.2 U4.10
N$26
  Top 0.254: R18.1 R19.2 71.75,67.43 71.37,67.06 67.31,67.06 66.8,67.56 66.8,68.58 66.04,69.34 62.48,69.34 62.23,69.09 62.23,68.17 U4.12
N$27
  Top 0.254: R11.2 46.09,73.27 46.99,74.42 52.07,74.42 53.09,73.15 54.86,73.15 U2.8
N$28
  Top 0.254: U8.5 54.97,62.23 58.93,62.23 59.74,61.42 U6.8 U6.9
N$29
  Top 0.254: U8.8 52.37,64.22 51.31,65.53 47.5,65.53 46.23,64.26 45.77,64.26 R10.2
N$30
  Top 0.254: U8.4 54.96,61.59 58.29,61.59 58.93,60.96 58.93,58.42 59.44,57.91 62.74,57.91 62.99,58.16 U6.13 U6.14
N$31
  Top 0.254: U8.12 49.02,62.23 48,62.23 47.12,61.47 47.12,58.93 47.88,58.17 58.17,58.17 59.44,56.9 59.44,55.88 60.2,55.37 61.98,55.37 62.57,55.97 U22.1 U22.2
N$32
  Top 0.254: U5.13 18.91,60.06 17.78,58.93 17.78,57.66 17.27,57.15 15.48,57.15 15.2,57.43 R66.2
N$33
  Top 0.61: U23.1 41.52,52.08 41.15,52.07 39.88,52.07 39.92,52.11 C32.1
N$34
  Top 0.254: U19.5 41.42,18.06 R29.2
N$35
  Top 0.254: U19.6 40.16,18.27 40.13,18.29 40.09,18.25 R28.2
N$36
  Top 0.254: U17.5 49.05,18.02 R25.2
N$37  (via drill 0.3, 0.38)
  Top 0.254: R45.2 66.89,54.7 66.8,54.74 66.67,54.86 v66.04,54.86 | U5.43 40.58,63.56 47.5,56.64 v52.58,56.64
  Bottom 0.254: v52.58,56.64 54.86,56.64 56.64,54.86 v66.04,54.86
N$38  (via drill 0.3, 0.38)
  Top 0.254: R52.2 76.22,53.06 75.18,54.1 v65.28,54.1 | U5.42 40.32,63.06 47.5,55.88 v53.34,55.88
  Bottom 0.254: v53.34,55.88 54.86,55.88 56.39,54.36 65.02,54.36 v65.28,54.1
N$39
  Top 0.254: U17.6 47.77,18.13 R24.2
N$40
  Top 0.406: U18.6 30.49,16.24 R22.2
N$41
  Top 0.254: R23.2 29,16.97 29.21,16.76 29.21,13.72 29.97,12.95 30.23,12.95 30.48,12.7 30.48,11.68 30.49,11.67 U18.1
N$42  (via drill 0.5)
  Top 0.305: 60.82,91.05 U20.P$1 | U15.7 U15.8
  Top 0.406: v60,92 60,91.05
  Top 0.635: U15.8 60,91.05 60.82,91.05
  Bottom 0.61: C37.P$1 v60,92
N$43  (via drill 0.4)
  Top 0.305: U15.4 56.42,89.7 57.15,90.42 56.9,90.42 56.95,90.37 U15.9
  Top 0.406: v57,90.38 U15.9
N$44
  Top 0.254: R6.2 73.89,22.84 74.86,23.8 U11.5
N$45
  Top 0.254: R20.2 U15.5
N$46
  Top 0.61: U23.14 53.61,48.91 C29.1
N$47
  Top 0.254: R20.1 60.53,87.97 60.96,88.39 60.96,89.01 U20.P$3
N$49
  Top 0.254: U21.6 17.08,47.3 17.78,48.01 17.78,51.04 R48.1
N$50
  Top 0.254: U21.7 16.43,51.39 16,51.82 16,53.17 R49.1
N$51
  Top 0.254: U6.3 62.36,64.91 62.36,63.75 62.61,63.5 64.01,63.5 64.52,64.01 71.63,64.01 71.75,64.13 C22.1 R21.1
N$52
  Top 0.254: U6.5 61.09,64.88 61.09,63.75 60.58,63.5 60.58,62.99 61.21,62.36 62.1,62.36 62.48,62.99 64.39,62.99 64.9,63.5 66.93,63.5 67.06,63.37 67.06,62.36 67.44,61.98 71.63,61.98 71.75,62.1 C23.1 R36.1
N$53
  Top 0.254: U6.10 60.96,59.2 60.96,60.33 60.71,60.58 60.71,61.47 61.34,61.85 65.79,61.85 67.56,60.07 71.63,60.07 71.75,60.19 C24.1 R37.1
N$54
  Top 0.254: U6.12 62.36,59.14 62.36,60.07 62.61,60.33 66.17,60.33 66.93,59.56 66.93,58.42 67.31,58.04 71.5,58.04 71.75,58.29 C25.1 R38.1
N$55
  Top 0.254: U22.3 61.21,56.32 61.21,56.64 61.72,57.15 66.8,57.15 67.31,56.64 67.31,56.13 67.56,55.88 71.63,55.88 71.75,56 C26.1 R39.1
N$56
  Top 0.254: U21.8 15.78,50.52 14.48,51.82 14.48,53.14 R50.1
N$57
  Top 0.254: U21.9 15.13,50.15 13.21,52.07 13.21,53.14 R51.1
N$58
  Top 0.254: U22.5 60.62,51.77 R40.1 C39.1
N$59  (via drill 0.38)
  Top 0.254: U5.33 32.01,53.33 33.78,51.56 33.78,43.43 38.35,38.86 v38.35,38.1 | v45.72,32.51 46.98,32.51 R67.2
  Bottom 0.254: v38.35,38.1 38.35,34.54 40.39,32.51 v45.72,32.51
N$60  (via drill 0.38)
  Top 0.254: U5.29 28.45,56.5 28.45,55.37 28.96,54.86 28.96,52.32 31.5,49.78 31.5,40.39 v33.78,38.1 | v33.78,34.54 33.78,33.21 R27.2
  Bottom 0.254: v33.78,38.1 v33.78,34.54
N$61  (via drill 0.38)
  Top 0.254: U5.31 29.46,53.09 32.26,50.29 32.26,41.4 v35.56,38.1 | v35.56,34.54 35.56,33.29 R26.2
  Bottom 0.254: v35.56,38.1 v35.56,34.54
N$63
  cutout Bottom (isolate 0.305, no thermals): 5,88 5,81 13,81 13,88
  cutout Bottom (isolate 0.305, no thermals): 81,89 81,81 89,81 89,89
  cutout Bottom (isolate 0.305, no thermals): 81,13 81,6 89,6 89,13
  cutout Bottom (isolate 0.305, no thermals): 5,13 5,5 13,5 13,13
N$64  (via drill 0.38)
  Top 0.254: U5.32 29.96,53.61 32.77,50.8 32.77,42.04 v37.21,37.59 | v45.72,31.5 45.47,31.5 44.7,32.26 44.2,32.26 R63.2 44.2,32.51
  Bottom 0.254: v37.21,37.59 37.21,34.92 40.39,31.75 45.47,31.75 45.47,31.5 v45.72,31.5
N$65
  Top 0.61: U16.14 53.9,18.77 54.62,19.5 54.62,20.07 BAT1.P
N$70
  Top 0.254: U21.5 17.73,46.94 19.05,48.26 19.05,51.24 R47.1
N$71
  Top 0.254: U21.4 18.38,46.06 20.57,48.26 20.57,51.18 R46.1
N$72
  Top 0.254: U21.3 19.03,45.44 22.1,48.51 22.1,51.31 22.06,51.31 R42.1
N$82
  Top 0.61: U23.8 42.33,41.49 43.18,40.64 45.59,40.64 D1.A
  Top 0.813: 36.32,43.43 38.61,43.43 L1.P$2 | L1.P$2
  Top 1.016: U23.8 36.31,42.55 36.32,43.43
N$90
  Top 0.61: C31.2 53.57,42.55 U23.9 51.56,42.45 51.56,41.15 50.62,40.46 D1.C
N$666
  Top 0.254: U12.1 59.54,81.94 59.18,82.3 59.18,83.31 59.69,83.82 60.55,83.82 U12.3
  Top 0.406: U3.7 64.76,82.03 C3.1 62.71,82.01 C35.1 U12.1
  Top 0.61: U3.7 U3.6
OBC_-FAULT  (via drill 0.38)
  Top 0.254: U3.8 69.33,80.75 69.33,80.03 70.87,78.49 v76.2,78.49 | v81.03,80.52 87.38,80.52 88.65,79.25 88.65,40.49 X1.34
  Bottom 0.254: v76.2,78.49 78.99,78.49 v81.03,80.52
OBC_OFF
  Top 0.254: U3.3 72.77,83.25 R3.2 C1.1 77,82.77 82.3,77.47 87.63,77.47 88.14,76.96 88.14,50.14 X1.26
OBC_WT_RST  (via drill 0.38)
  Top 0.254: C4.1 9.82,64.94 v9.91,65.02 | v14.22,73.03 20.18,73.03 U7.3
  Top 0.305: U10.7 8.68,64.9 C4.1
  Bottom 0.254: v9.91,65.02 10.67,65.02 12.19,66.55 12.19,70.99 v14.22,73.03
PANELTEMP_SCL  (via drill 0.38)
  Top 0.254: X1.29 82.8,42.26 82.8,41.4 80.92,39.52 U1.11 73.26,39.52 v73.15,39.62
  Bottom 0.254: v73.15,39.62 70.88,39.62 R56.1
PANELTEMP_SDA  (via drill 0.38)
  Top 0.254: X1.31 83.81,40.65 83.82,40.64 83.57,40.64 81.79,38.87 U1.10 73.79,38.87 v73.53,38.61
  Bottom 0.254: v73.53,38.61 73.53,37.72 73.41,37.59 72.52,37.59 72.39,37.72 R62.1 72.39,38.35
RESETOBC  (via drill 0.38)
  Top 0.254: U5.58 25.46,71.31 24.64,72.14 24.64,73.15 | 24.64,73.15 24.64,73.23 R2.1 | U7.4 24.54,73.05 24.64,73.15 | 24.89,73.41 24.64,73.15 | R2.1 24.62,73.17 24.64,73.15 | R8.2 28.54,82.64 v26.42,80.52 | v26.42,76.96 26.42,73.79 25.78,73.15 24.72,73.15 R2.1
  Bottom 0.254: v26.42,80.52 v26.42,76.96
RTC_-INT  (via drill 0.38)
  Top 0.254: 26.92,58.67 26.92,56.55 U5.26 26.96,58.96 v27.18,59.18 | v55.51,5.75 55.38,5.75
  Top 0.305: 55.38,5.75 54.46,5.75 R64.1
  Top 0.61: U16.3 53.9,6.49 R64.1
  Bottom 0.254: v27.18,59.18 27.18,56.39 28.7,54.86 28.7,40.39 27.43,39.12 27.43,12.19 31.75,7.87 51.82,7.87 53.08,6.48 55.14,6.48 v55.51,5.75
RTC_-RST  (via drill 0.38)
  Top 0.254: 26.42,58.67 26.42,56.55 U5.25 26.46,58.88 v26.16,59.18 | U16.4 55.16,7.21 55.12,7.25 55.41,6.75 v57.03,5.75
  Bottom 0.254: v26.16,59.18 26.16,56.39 27.94,54.61 27.94,40.89 26.67,39.62 26.67,11.94 31.75,6.86 51.31,6.86 53.2,4.59 56.52,4.59 57.03,5.23 v57.03,5.75
RXD1  (via drill 0.38)
  Top 0.254: U5.35 33.4,59.56 v33.53,59.69
  Bottom 0.254: v33.53,59.69 33.53,74.93 39.62,81.03 48.26,81.03 49.02,80.26 49.02,78.74 48.98,78.74 U13.1
SC_-ON  (via drill 0.38)
  Top 0.254: U21.19 17.08,32.96 22.86,27.18 57.91,27.18 59.69,25.4 v65.79,25.4
  Bottom 0.254: v65.79,25.4 79.25,25.4 83.06,29.21 84.99,29.21 X1.40
SC_-ON_IN
  Top 0.254: R47.2 19.06,53.61 20.57,55.12 22.73,55.12 22.99,55.37 22.99,56.48 U5.18
SC_-PFO  (via drill 0.38)
  Top 0.254: U21.16 15.13,31.36 21.59,24.89 56.9,24.89 v67.06,14.73 | v79.5,15.49 82.04,15.49 82.8,16.51 84.58,16.51 85.09,17.02 85.09,19.15 X1.48
  Bottom 0.254: v67.06,14.73 78.74,14.73 v79.5,15.49
SC_-PFO_IN
  Top 0.254: U5.15 19.44,59.06 19.05,58.67 19.05,57.15 17.78,55.88 15.24,55.88 14.73,55.37 14.73,54.89 R50.2
SCCHG_EN
  Top 0.254: R69.1 80.94,51.48 82.8,53.34 X1.21
SCCHG_EN_OUT  (via drill 0.3, 0.38)
  Top 0.254: R69.2 76.79,51.48 74.55,53.47 v66.17,53.47 | U5.41 40.06,62.56 47.5,55.12 v54.1,55.12
  Bottom 0.254: v54.1,55.12 54.36,55.12 55.88,53.59 v66.17,53.47
SCOUT_-PG  (via drill 0.38)
  Top 0.254: U21.15 14.48,30.99 21.34,24.13 56.64,24.13 v67.56,13.21
  Bottom 0.254: v67.56,13.21 79.76,13.21 82.93,16.51 84.99,16.51 X1.50
SCOUT_-PG_IN
  Top 0.254: U5.14 19.17,59.56 18.29,58.67 18.29,57.4 17.27,56.39 13.72,56.39 12.95,55.63 12.95,54.89 R51.2
SCOUT_EN
  Top 0.254: R70.1 80.59,49.86 82.8,52.07 84.99,52.07 X1.22
SCOUT_EN_OUT  (via drill 0.3, 0.38)
  Top 0.254: R70.2 76.89,49.86 73.91,52.83 v64.77,52.83 | U5.40 39.79,62.06 47.5,54.36 v53.34,54.36
  Bottom 0.254: v53.34,54.36 54.36,54.36 55.88,52.83 v64.77,52.83
SECONDARY_SCL  (via drill 0.38)
  Top 0.254: U11.7 76.29,25.57 76.96,24.89 76.96,22.86 v77.47,22.35
  Bottom 0.254: v77.47,22.35 77.47,19.81 78.49,18.8 82.2,18.8 X1.47
SECONDARY_SDA  (via drill 0.38)
  Top 0.254: U11.6 75.92,24.91 76.45,24.38 76.45,21.84 v76.71,21.59
  Bottom 0.254: v76.71,21.59 76.71,19.56 78.74,17.53 83.57,17.53 83.82,17.78 83.81,17.79 X1.49
SOLAR_-ON  (via drill 0.38)
  Top 0.254: U21.21 18.38,34.2 23.62,28.96 58.42,28.96 59.94,27.43 v61.47,27.43
  Bottom 0.254: v61.47,27.43 75.95,27.43 82.8,34.29 84.99,34.29 X1.36
SOLAR_-ON_IN
  Top 0.254: U5.20 23.96,54.95 23.11,54.1 22.35,54.1 22.1,53.85 22.1,52.85 R42.2
SOLAR_CS1
  Top 0.254: R21.2 75.16,65 75.06,64.77 75.06,62.23 75.18,61.98 81.03,61.98 82.04,60.96 X1.15
SOLAR_CS2
  Top 0.254: R36.2 81.53,63 82.3,62.23 84.99,62.23 X1.14
SOLAR_CS3
  Top 0.254: R37.2 80.48,61 83.06,58.42 X1.17 | 83.82,58.42 X1.17 | X1.17
SOLAR_CS4  (via drill 0.38)
  Top 0.254: R38.2 80.7,59 v80.77,58.93
  Bottom 0.254: v80.77,58.93 82.04,58.93 82.8,59.69 84.99,59.69 X1.16
SOLAR_CS5
  Top 0.254: R39.2 82.65,57 82.8,57.15 84.99,57.15 X1.18
SUN  (via drill 0.6)
  Top 0.254: R40.2 | X4.1 68.25,47.75 71,45 v74,45
  Top 0.61: X4.1 R40.2
  Bottom 0.254: v74,45 81.75,45 82.5,45.75 83.71,45.75 X1.27
SUN_IN
  Top 0.254: U22.7 U22.6 61.27,53.61 61.25,53.62 61.25,54.25 61.12,54.38 59.5,54.38 59.38,54.25 59.38,53.5 58.88,53 57.12,53 56.62,53.5 56.62,55 54.12,57.5 47.75,57.5 46.62,58.62 46.62,61.88 47.67,62.92 U8.11
TEMP_-ALERT  (via drill 0.38)
  Top 0.254: U5.27 27.43,56.48 27.43,54.48 27.81,54.1 27.81,50.93 29.72,49.02 29.72,39.37 v30.23,38.86 | v33.27,10.16 34.04,10.92 34.04,12.21 R65.2 33.94,12.19 33.02,12.19 32.47,11.64 U18.3
  Bottom 0.254: v30.23,38.86 30.23,11.68 32,9.91 33.02,9.91 v33.27,10.16
TXD1  (via drill 0.38)
  Top 0.254: U5.34 33.91,59.06 v34.8,59.44
  Bottom 0.254: v34.8,59.44 34.8,73.41 40.13,78.74 45.05,78.74 U13.4
VBAT
  Top 0.254: R16.2 79.8,69.98 X1.11 X1.12
VBUS  (via drill 0.38)
  Top 0.254: R14.2 78.33,71.98 79.38,73.03 | U21.23 U21.24 20.33,33.39 24,29.59 59.82,29.59 v60.71,28.7
  Top 0.406: U3.2 U3.1 76.22,80.75 78.74,78.23 78.74,73.66 79.38,73.03 81.28,71.12 X1.7 | X1.7 | X1.7 X1.8 | X1.8 | X1.8 X1.10 X1.9
  Bottom 0.254: v60.71,28.7 74.93,28.7 83.06,36.83 86.87,36.83 87.88,37.85 87.88,66.98 X1.10
  pour Top (no thermals): 71.63,82.3 71.63,80.52 73.91,80.52 76.2,80.52 78.74,77.98 78.74,72.64 83.31,68.07 87.12,68.07 87.12,71.37 86.87,71.63 82.55,71.63 80.52,73.66 80.52,77.98 76.2,82.3
VREF_EXT  (via drill 0.38)
  Top 0.254: U5.10 21.68,61.56 v22.1,61.98 | v14.99,67.31 14.99,68.81 C33.2 U9.4
  Bottom 0.254: v22.1,61.98 22.1,63.25 21.84,63.5 18.8,63.5 v14.99,67.31
VSOLAR  (via drill 0.38)
  Top 0.254: R7.2 76.38,73.98 v76.96,73.91
  Top 0.635: U20.P$5 65.22,90.99 v65.28,90.93
  Bottom 0.61: C38.P$1 65,91 65,90.93 v65.28,90.93
  Bottom 0.635: v65.28,90.93 65.28,88.39 65.79,87.88 65.79,80.52 70.1,76.2 74.68,76.2 v76.96,73.91 83.57,73.91 83.82,73.66 X1.6 X1.5
VSUPERCAP
  Top 0.254: R18.2 79.26,67.98 X1.13